# Altium schematic sheet 02-MCU.SchDoc
size B
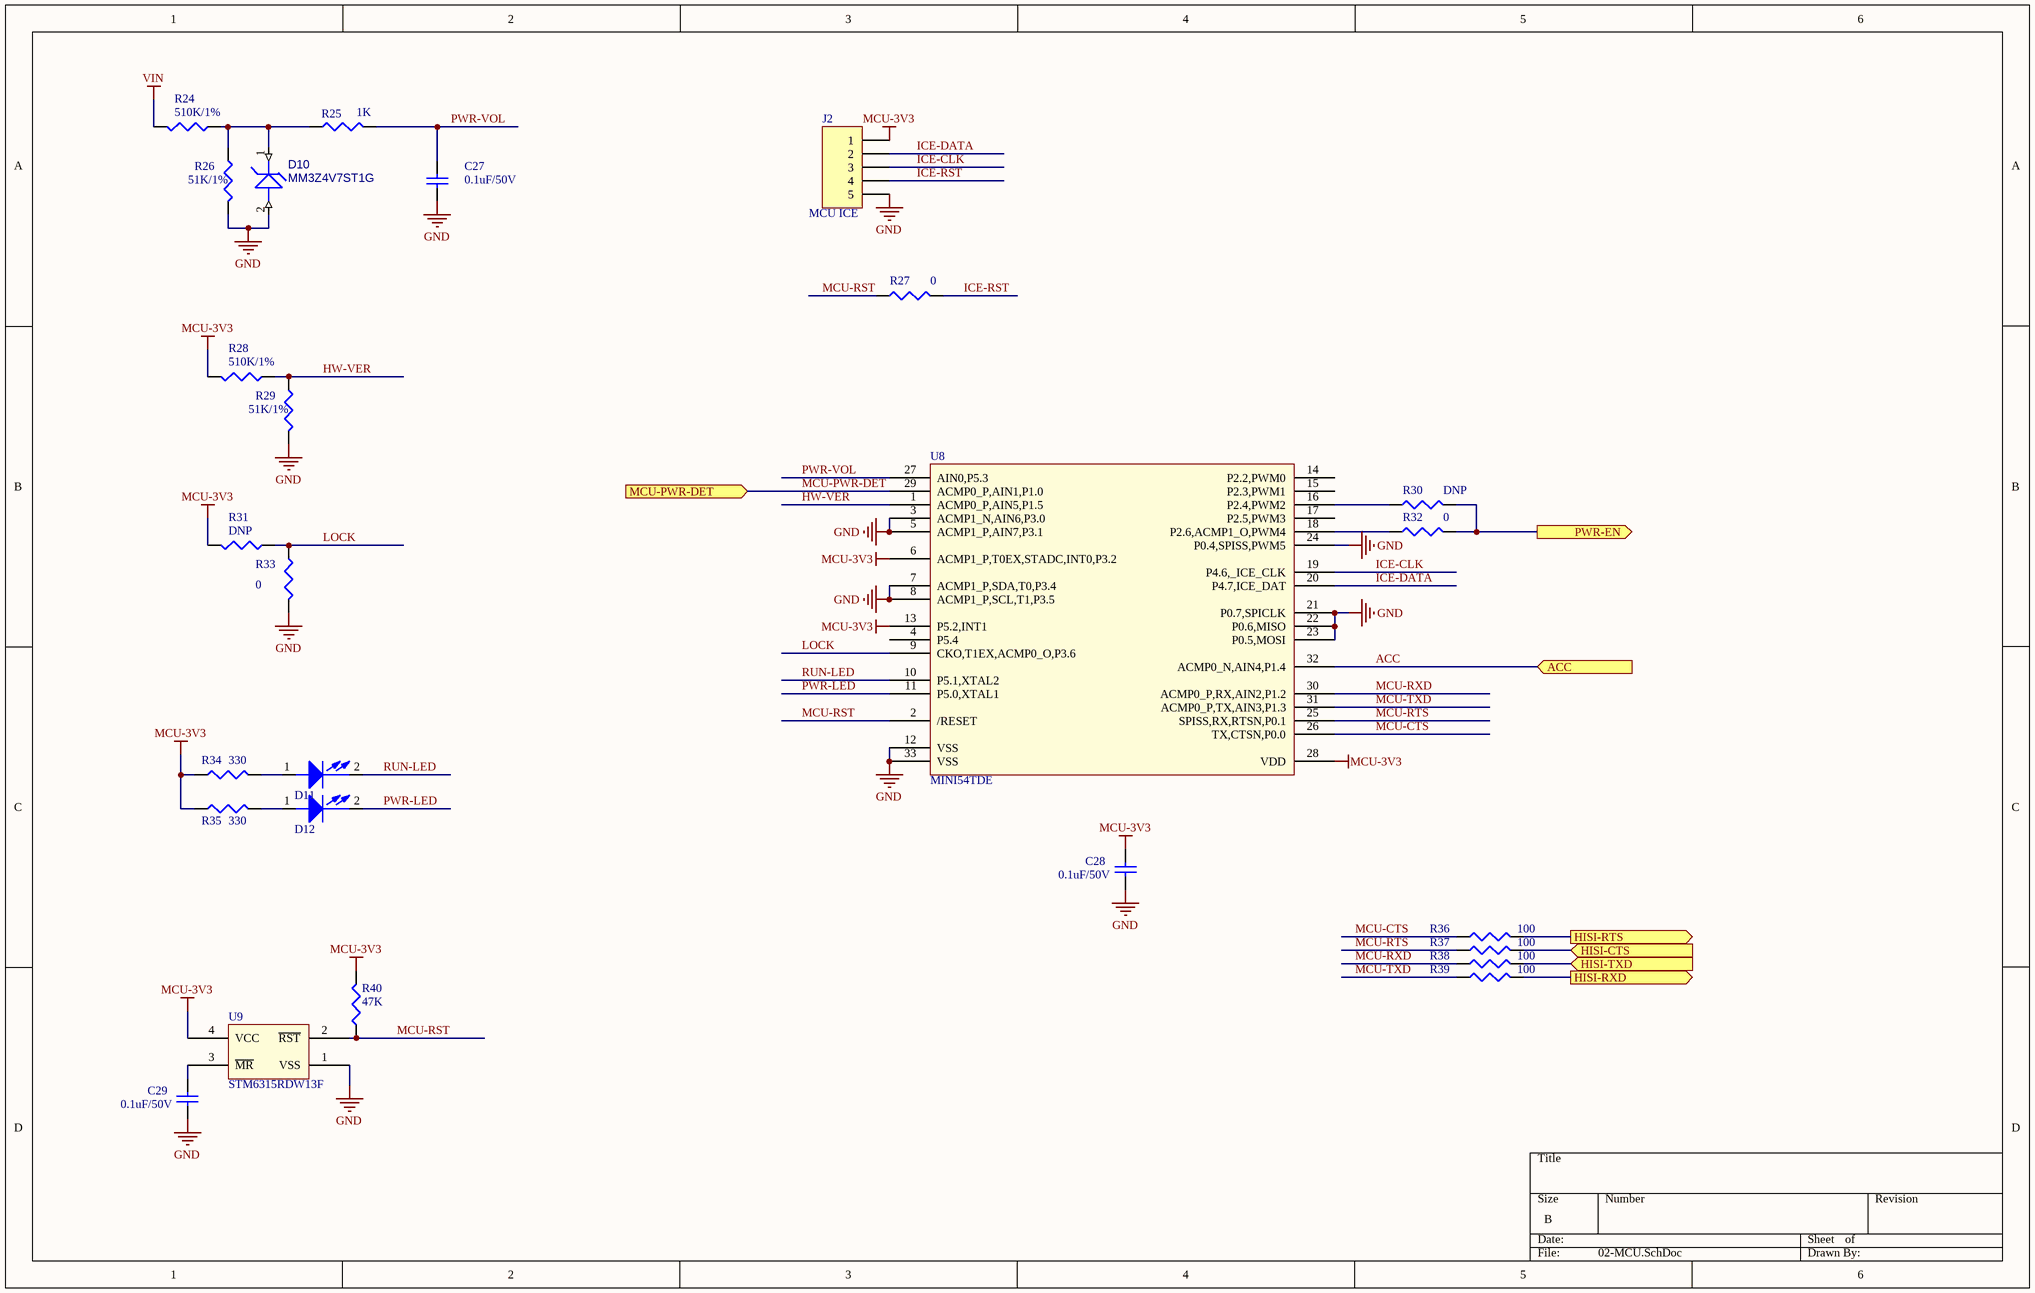
[diagram p0: 02-MCU.SchDoc]

## Parts
C27  0.1uF/50V  [0402]
C28  0.1uF/50V  [0402]
C29  0.1uF/50V  [0402]
D10  MM3Z4V7ST1G  [SOD323F]
D11  LED GREEN  [LED0603]  (value not drawn)
D12  LED GREEN  [LED0603]  (value not drawn)
J2  MCU ICE  [HDR1X5]
R24  510K/1%  [0402]
R25  1K  [0402]
R26  51K/1%  [0402]
R27  0  [0402]
R28  510K/1%  [0402]
R29  51K/1%  [0402]
R30  DNP  [0402]
R31  DNP  [0402]
R32  0  [0402]
R33  0  [0402]
R34  330  [0402]
R35  330  [0402]
R36  100  [0402]
R37  100  [0402]
R38  100  [0402]
R39  100  [0402]
R40  47K  [0402]
U8  MINI54TDE  [QFN33]
U9  STM6315RDW13F  [SOT143-4]

## Ports
ACC (in), HISI-CTS (in), HISI-RTS (out), HISI-RXD (out), HISI-TXD (in), MCU-PWR-DET (in), PWR-EN (out)

## Nets
GND: C27.2 C28.2 C29.2 D10.2 J2.5 R26.2 R29.2 R33.2 U8.3(ACMP1_N,AIN6,P3.0) U8.5(ACMP1_P,AIN7,P3.1) U8.7(ACMP1_P,SDA,T0,P3.4) U8.8(ACMP1_P,SCL,T1,P3.5) U8.12(VSS) U8.21(P0.7,SPICLK) U8.22(P0.6,MISO) U8.23(P0.5,MOSI) U8.24(P0.4,SPISS,PWM5) U8.33(VSS) U9.1(VSS)
MCU-3V3: C28.1 J2.1 R28.2 R31.2 R34.1 R35.1 R40.2 U8.6(ACMP1_P,T0EX,STADC,INT0,P3.2) U8.13(P5.2,INT1) U8.28(VDD) U9.4(VCC)
VIN: R24.2
ACC: U8.32(ACMP0_N,AIN4,P1.4) ; port ACC
HISI-CTS: R37.2 ; port HISI-CTS
HISI-RTS: R36.2 ; port HISI-RTS
HISI-RXD: R39.2 ; port HISI-RXD
HISI-TXD: R38.2 ; port HISI-TXD
HW-VER: R28.1 R29.1 U8.1(ACMP0_P,AIN5,P1.5)
ICE-CLK: J2.3 U8.19(P4.6,_ICE_CLK)
ICE-DATA: J2.2 U8.20(P4.7,ICE_DAT)
ICE-RST: J2.4 R27.2
LOCK: R31.1 R33.1 U8.9(CKO,T1EX,ACMP0_O,P3.6)
MCU-CTS: R36.1 U8.26(TX,CTSN,P0.0)
MCU-PWR-DET: U8.29(ACMP0_P,AIN1,P1.0) ; port MCU-PWR-DET
MCU-RST: R27.1 R40.1 U8.2(/RESET) U9.2(~{RST})
MCU-RTS: R37.1 U8.25(SPISS,RX,RTSN,P0.1)
MCU-RXD: R38.1 U8.30(ACMP0_P,RX,AIN2,P1.2)
MCU-TXD: R39.1 U8.31(ACMP0_P,TX,AIN3,P1.3)
PWR-EN: R30.2 R32.2 ; port PWR-EN
PWR-LED: D12.2(CATHODE) U8.11(P5.0,XTAL1)
PWR-VOL: C27.1 R25.2 U8.27(AIN0,P5.3)
RUN-LED: D11.2(CATHODE) U8.10(P5.1,XTAL2)
NetC29_1: C29.1 U9.3(~{MR})
NetD10_1: D10.1 R24.1 R25.1 R26.1
NetD11_1: D11.1(ANODE) R34.2
NetD12_1: D12.1(ANODE) R35.2
NetR30_1: R30.1 U8.16(P2.4,PWM2)
NetR32_1: R32.1 U8.18(P2.6,ACMP1_O,PWM4)

Not connected (* = marked no-connect by the designer): U8 4(P5.4) 14(P2.2,PWM0) 15(P2.3,PWM1) 17(P2.5,PWM3)

## Library data of the parts
C27-C29 = Cap: Capacitor; Published: 8-Jun-2000; LatestRevisionDate: 17-Jul-2002; LatestRevisionNote: Re-released for DXP Platform.; PackageReference: RAD-0.3; Publisher: Altium Limited; PackageDescription: Radial Cap, Thru-Hole; 2 Leads; 0.3 in Pin Spacing
D10 = MMGZ5231BPTLL34
D11 D12 = LN01401_1
J2 = Header 5: Header, 5-Pin; LatestRevisionDate: 17-Jul-2002; LatestRevisionNote: Re-released for DXP Platform.; Publisher: Altium Limited
R24 R26-R33 R36-R39 = Res3: Resistor; Value: 1K; Published: 8-Jun-2000; LatestRevisionDate: 29-May-2009; LatestRevisionNote: IPC-7351 Footprint Added.; PackageReference: J1-0603; Publisher: Altium Limited; PackageDescription: Chip Resistor
R25 R40 = Res3: Resistor; Published: 8-Jun-2000; LatestRevisionDate: 29-May-2009; LatestRevisionNote: IPC-7351 Footprint Added.; PackageReference: J1-0603; Publisher: Altium Limited; PackageDescription: Chip Resistor
  R25: Value: 1K
R34 R35 = CR16-1003FM
U9 = STM6315